# EasyEDA Pro project OpenCardiographySignalMeasuringDevice.epro, schematic MasterProject

## Sheets
1 Power
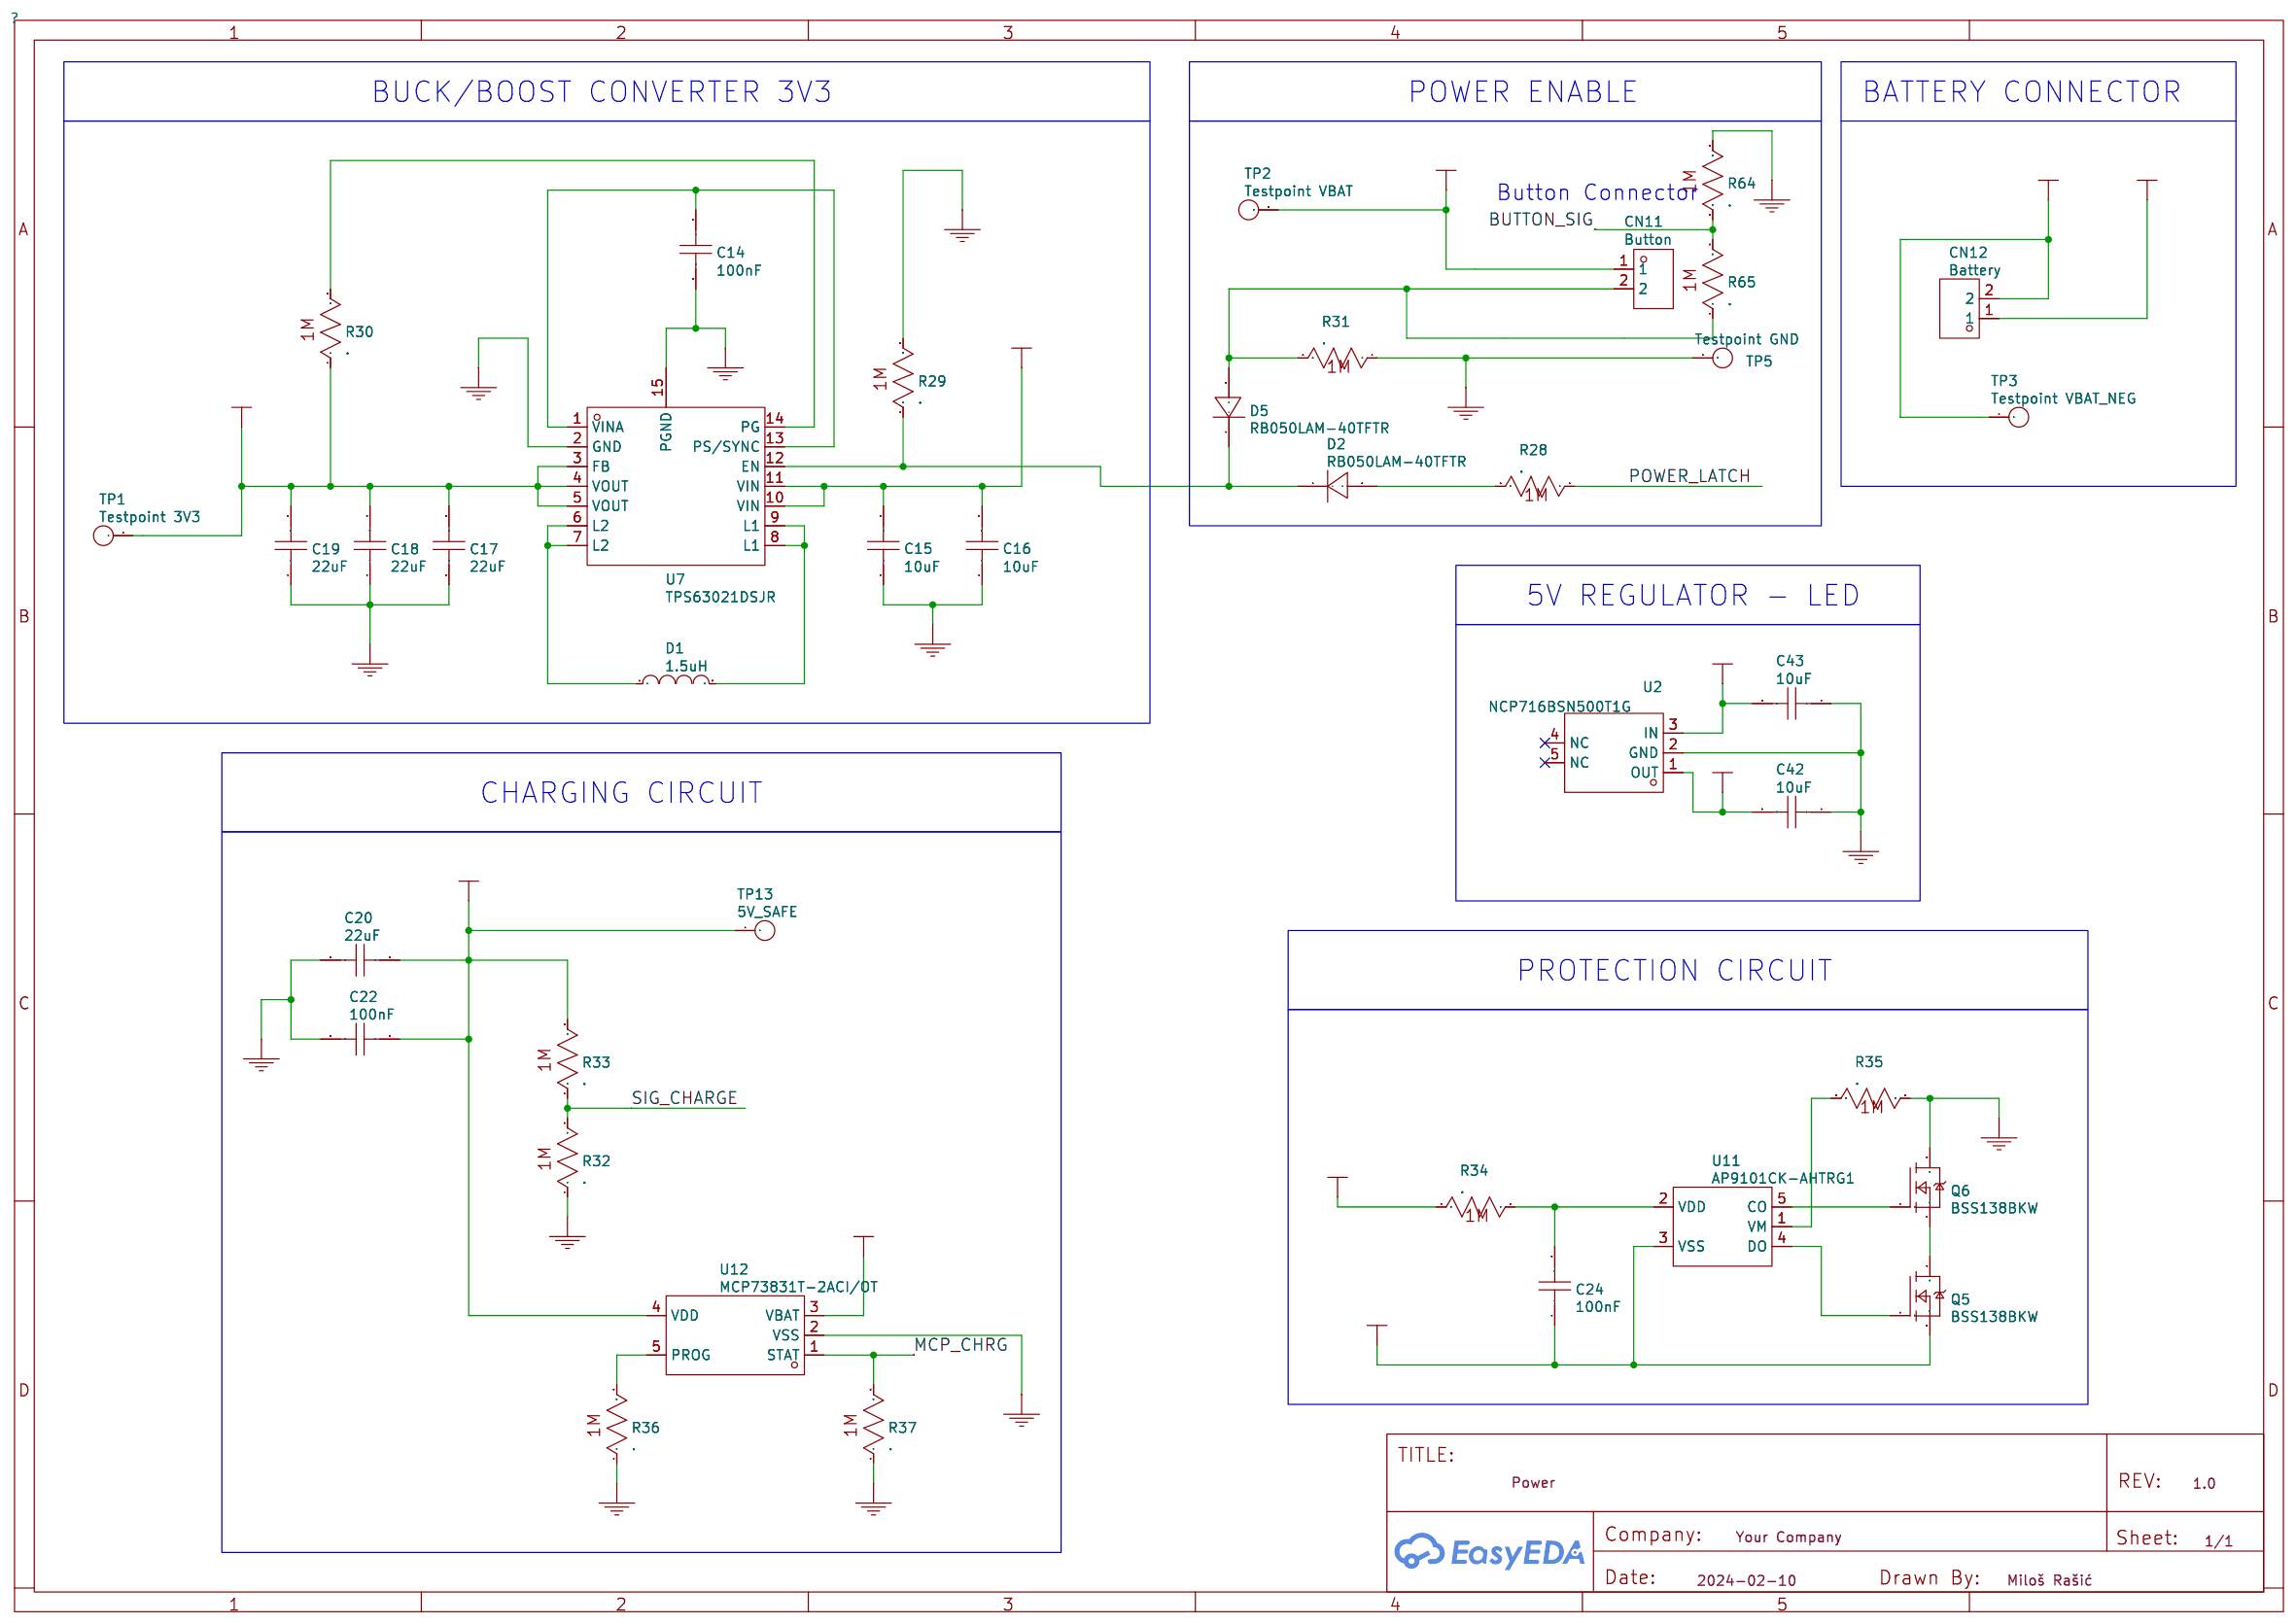
[diagram p0: Power]
2 ECG
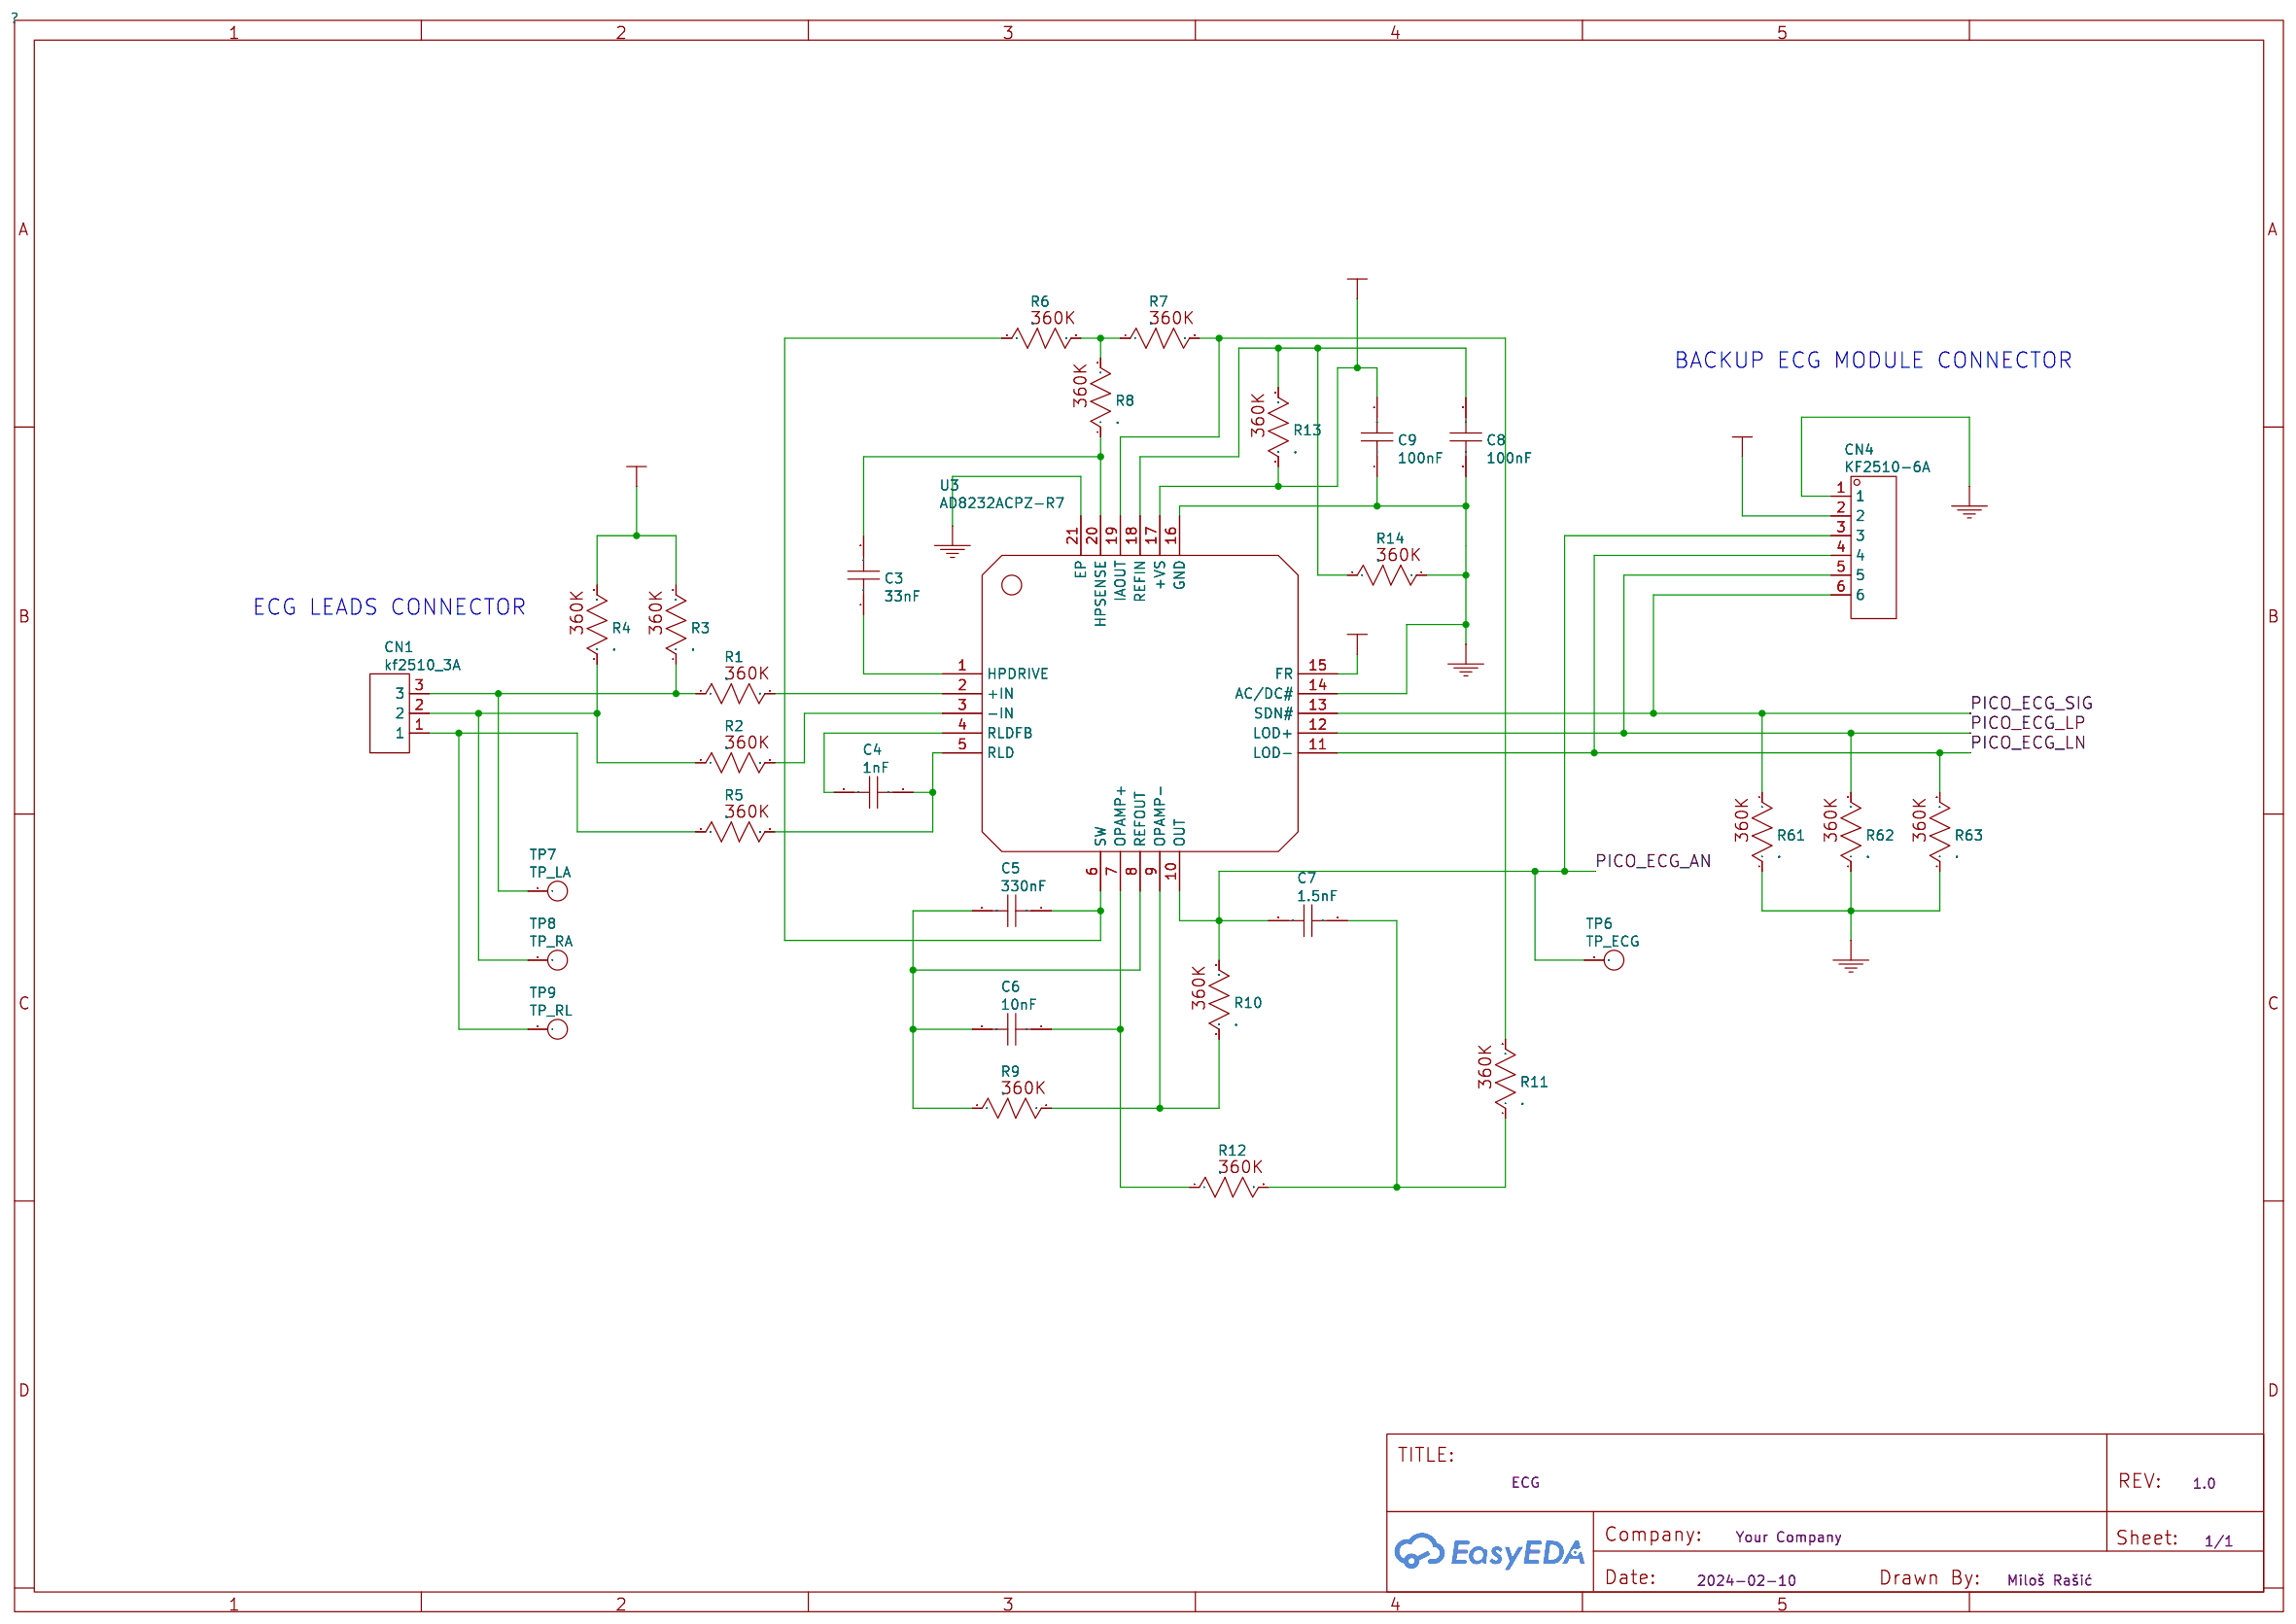
[diagram p1: ECG]
3 USB Isolator
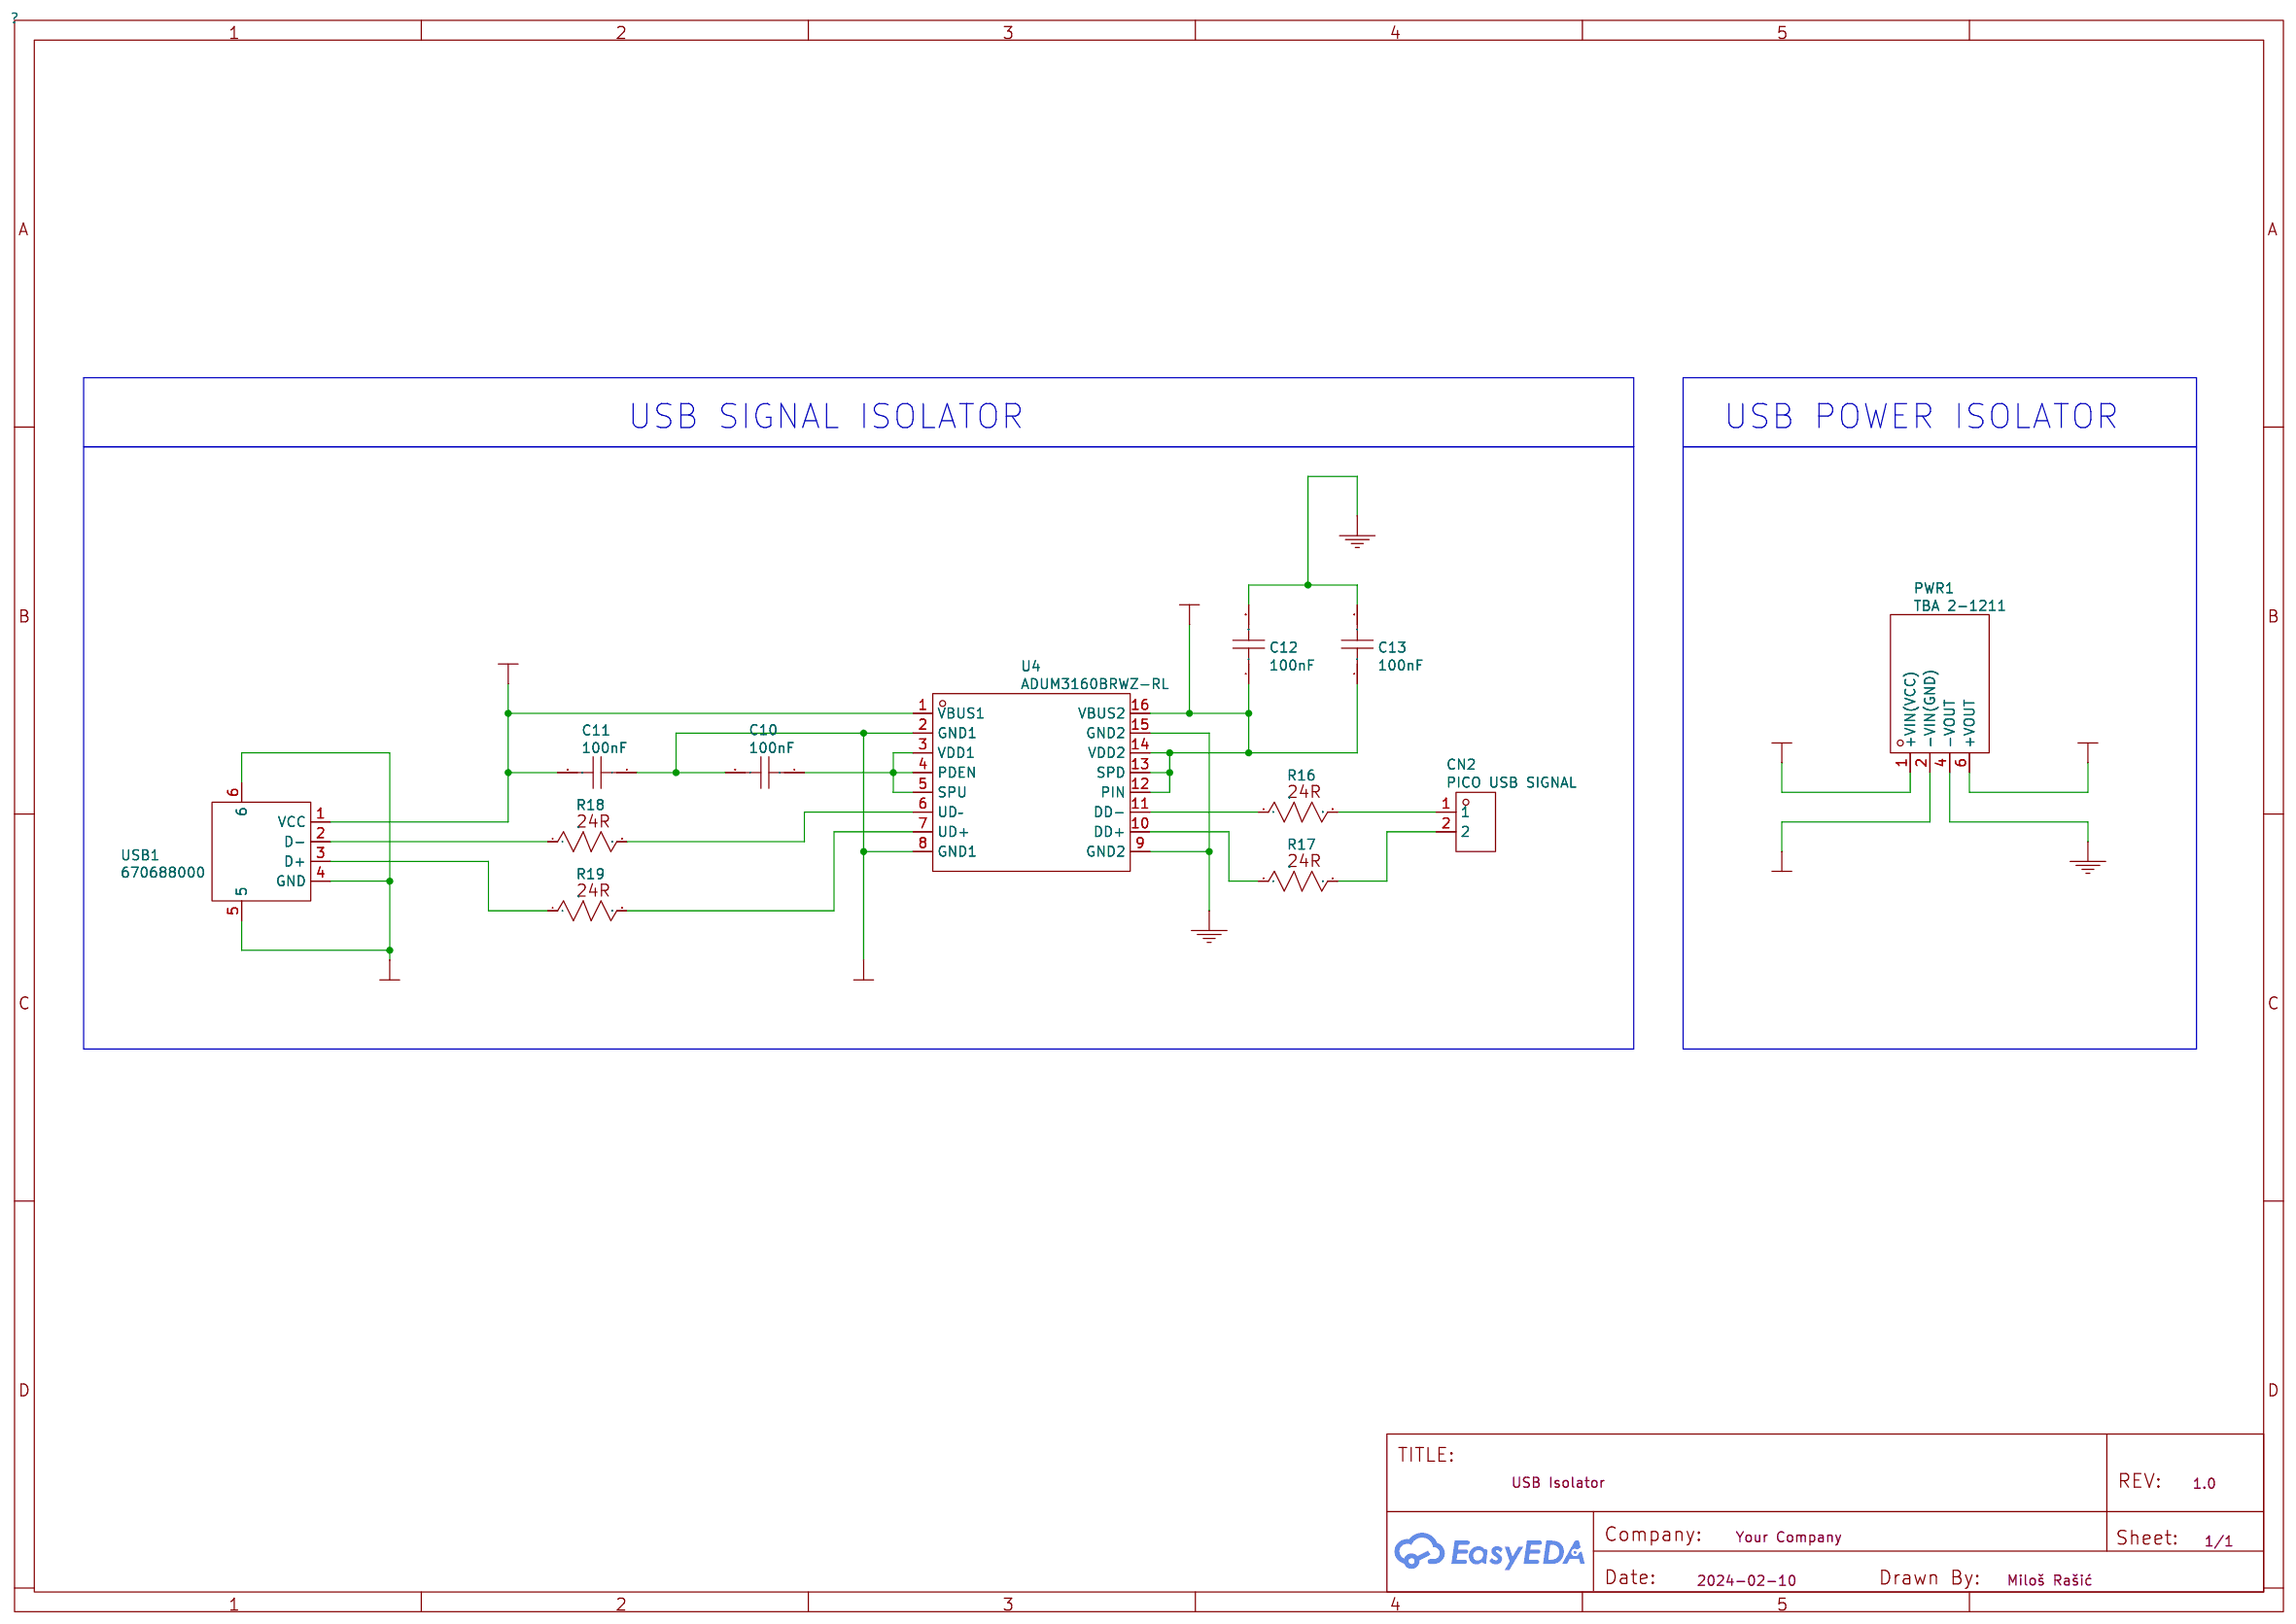
[diagram p2: USB Isolator]
4 MCU - Pico
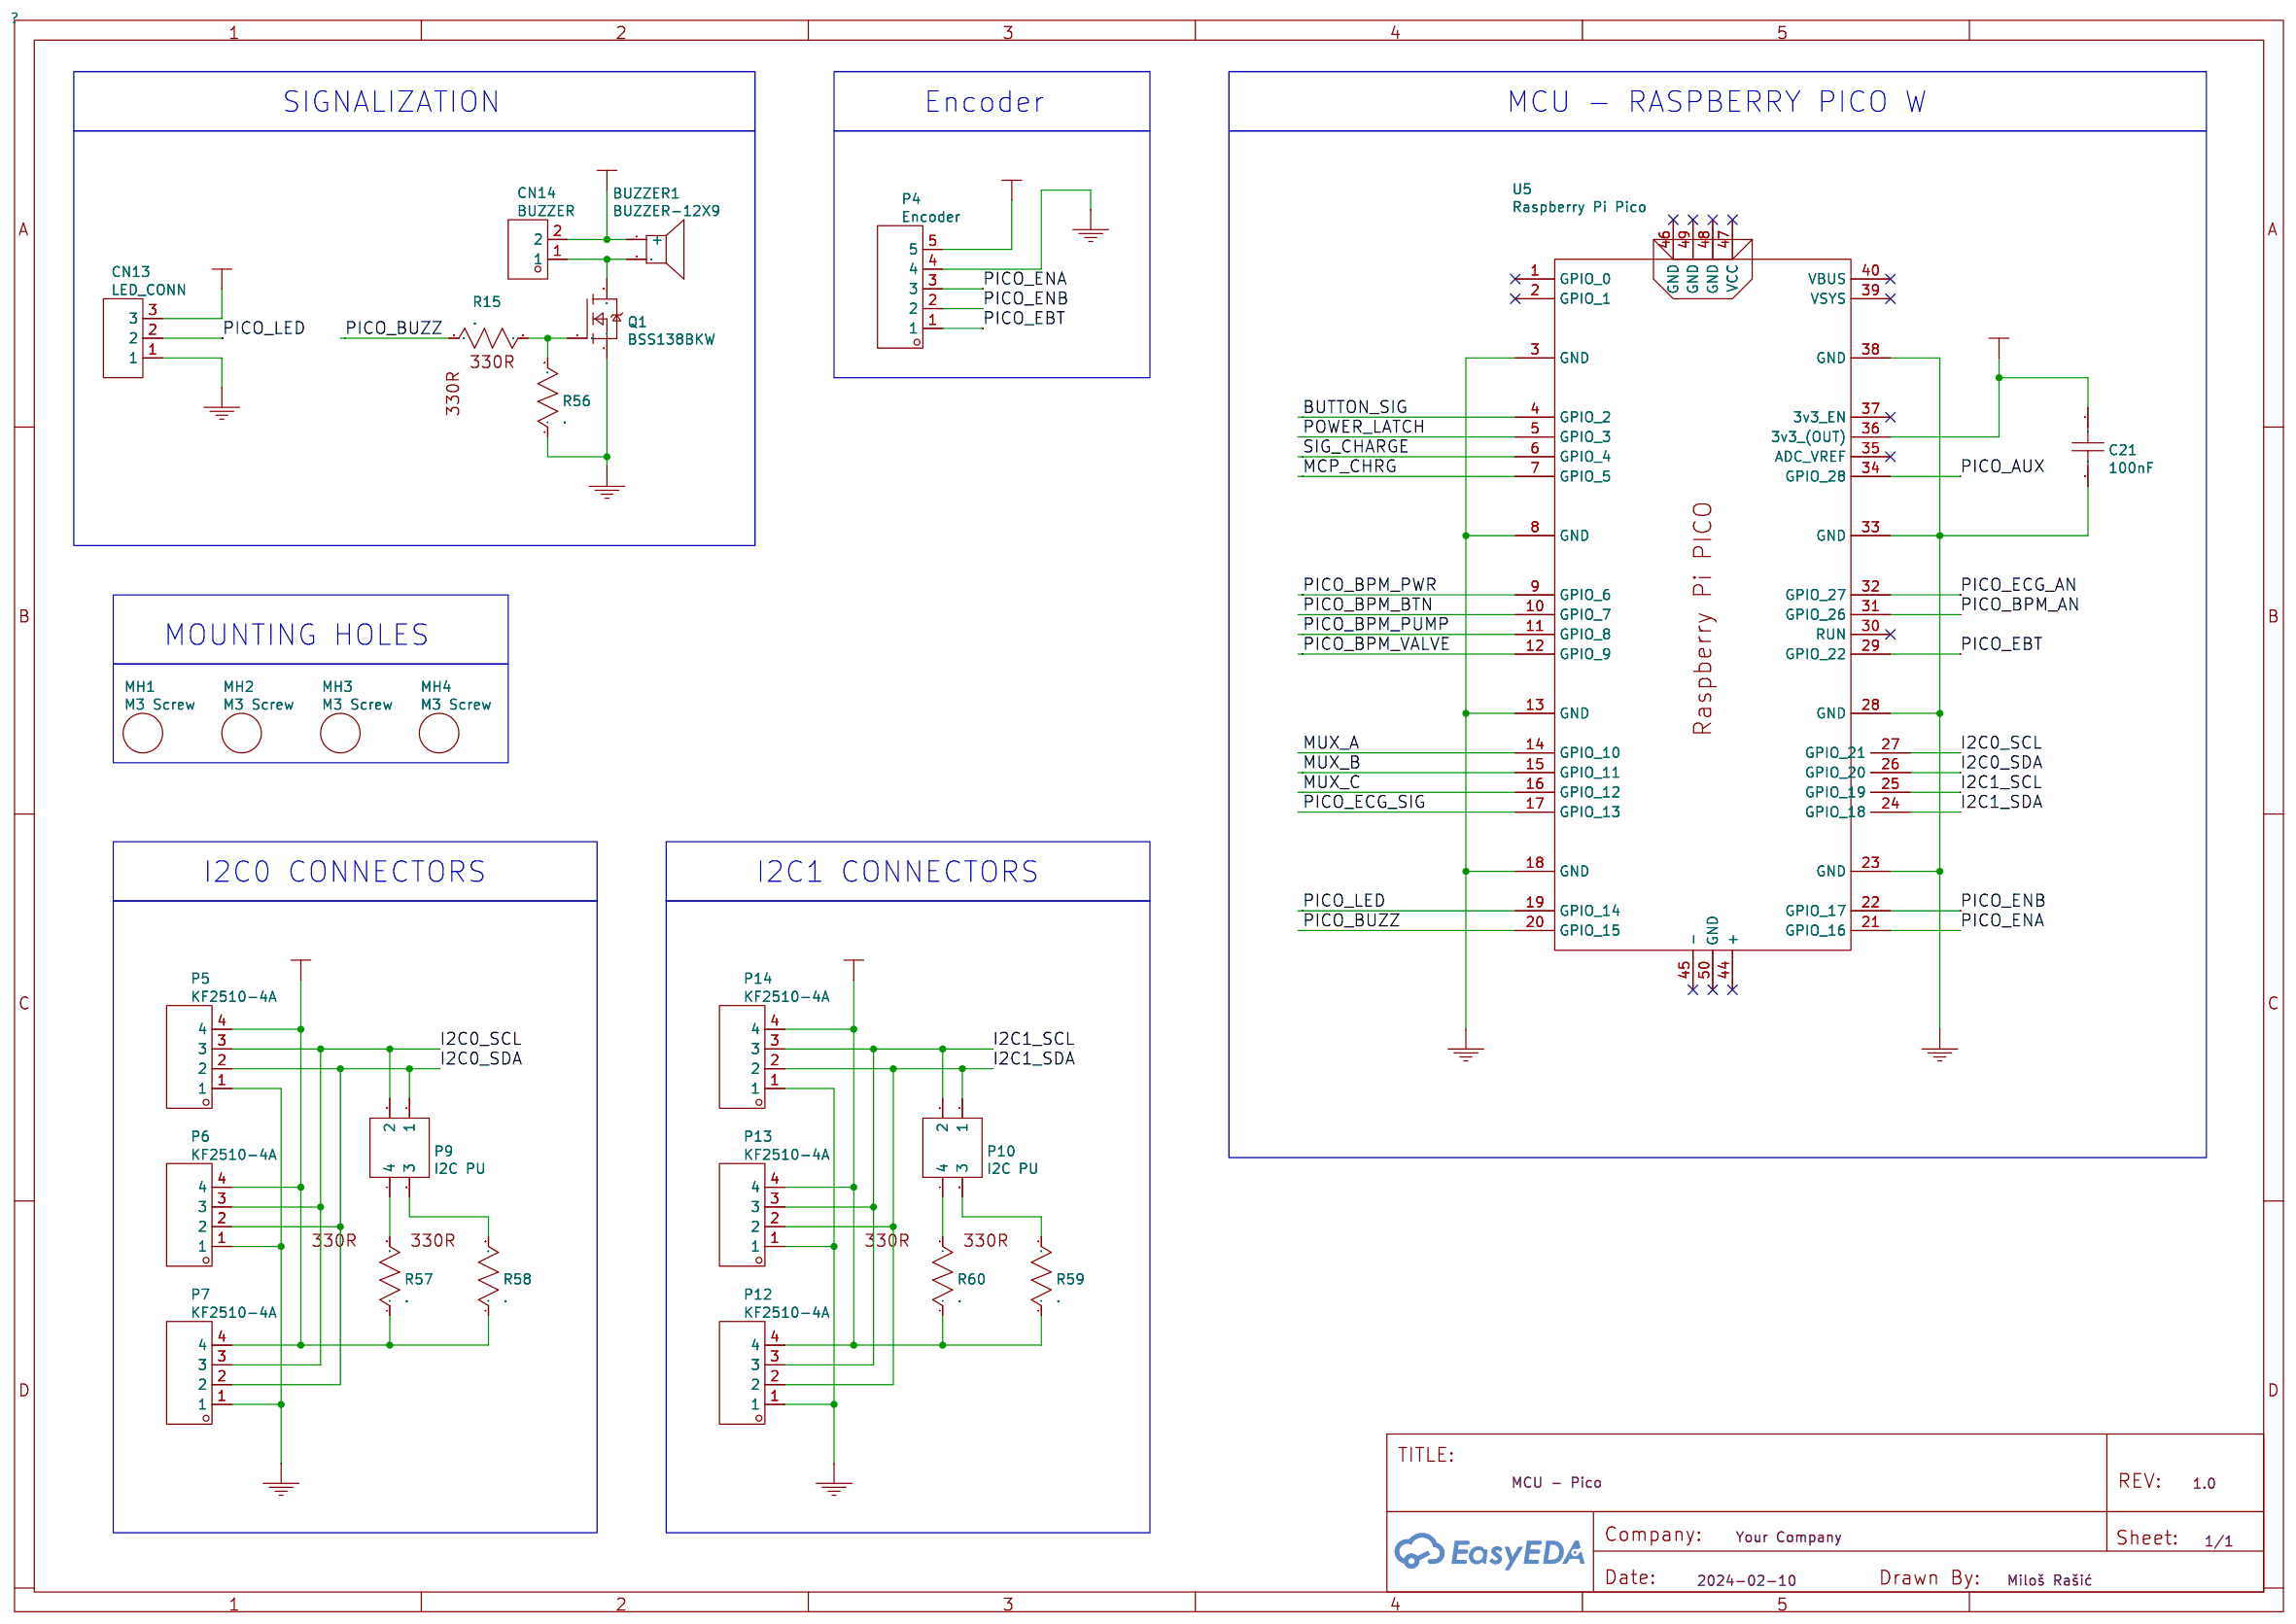
[diagram p3: MCU - Pico]
5 AUX Input
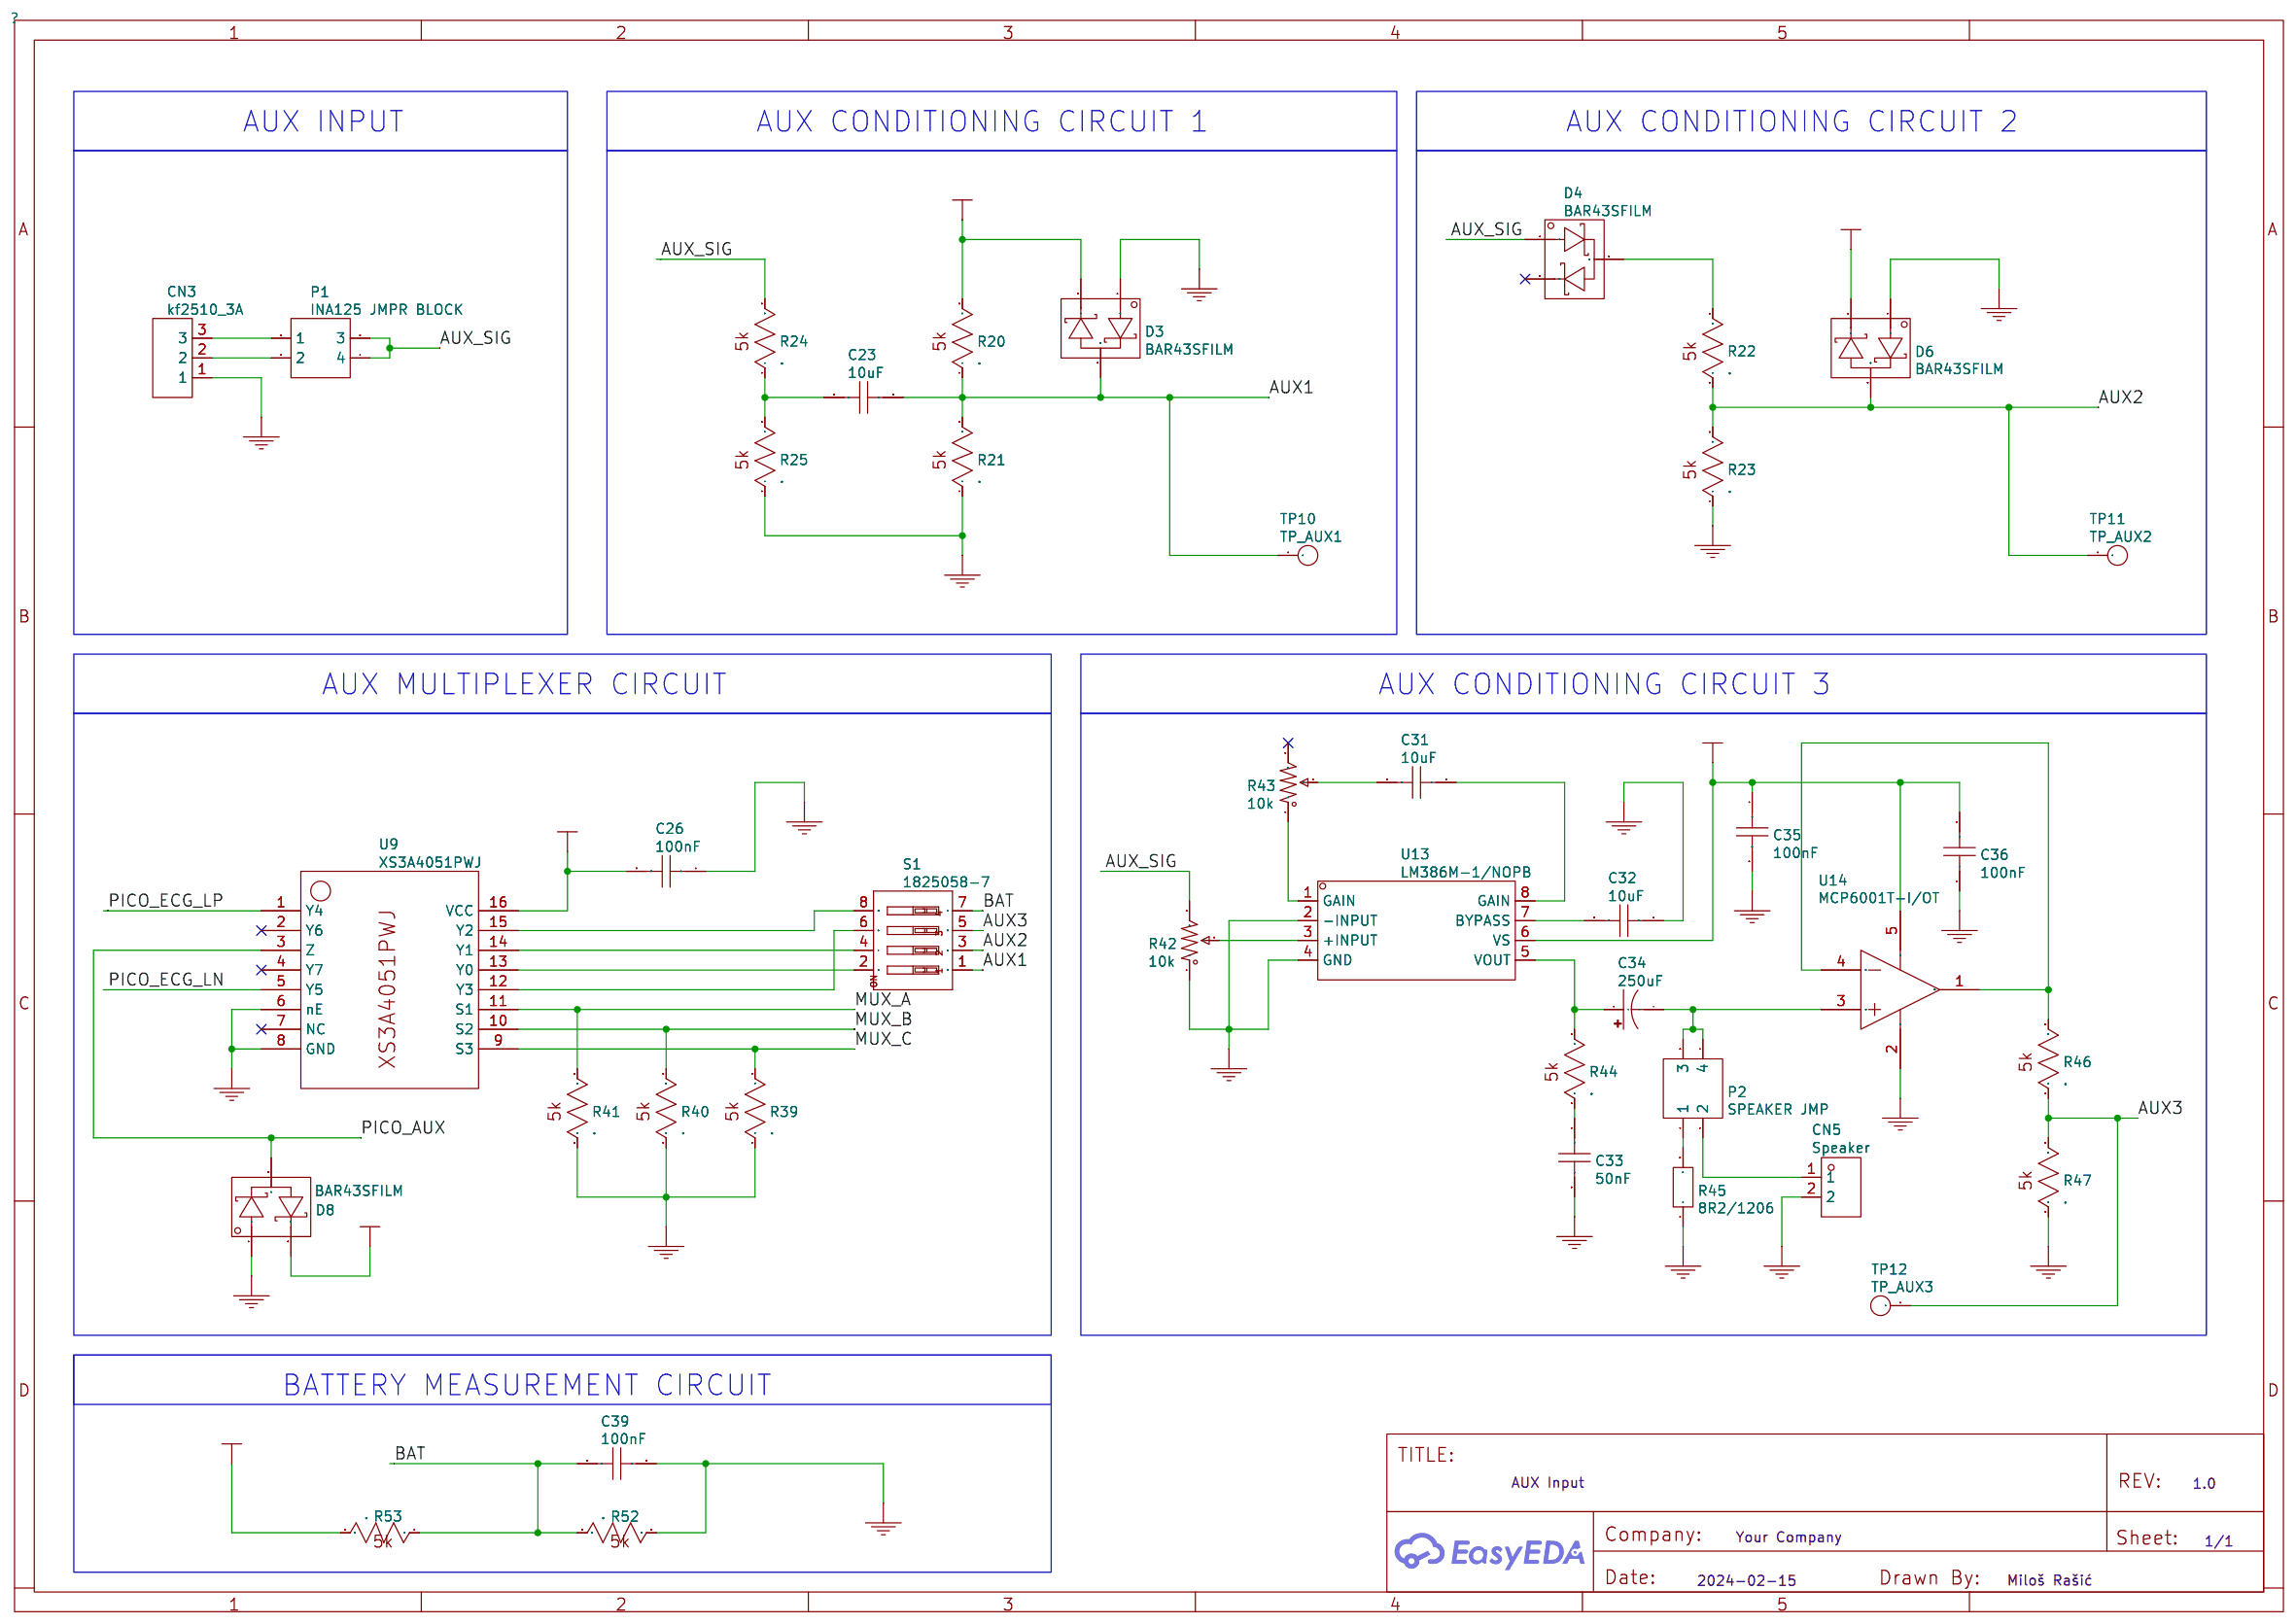
[diagram p4: AUX Input]
6 BPM
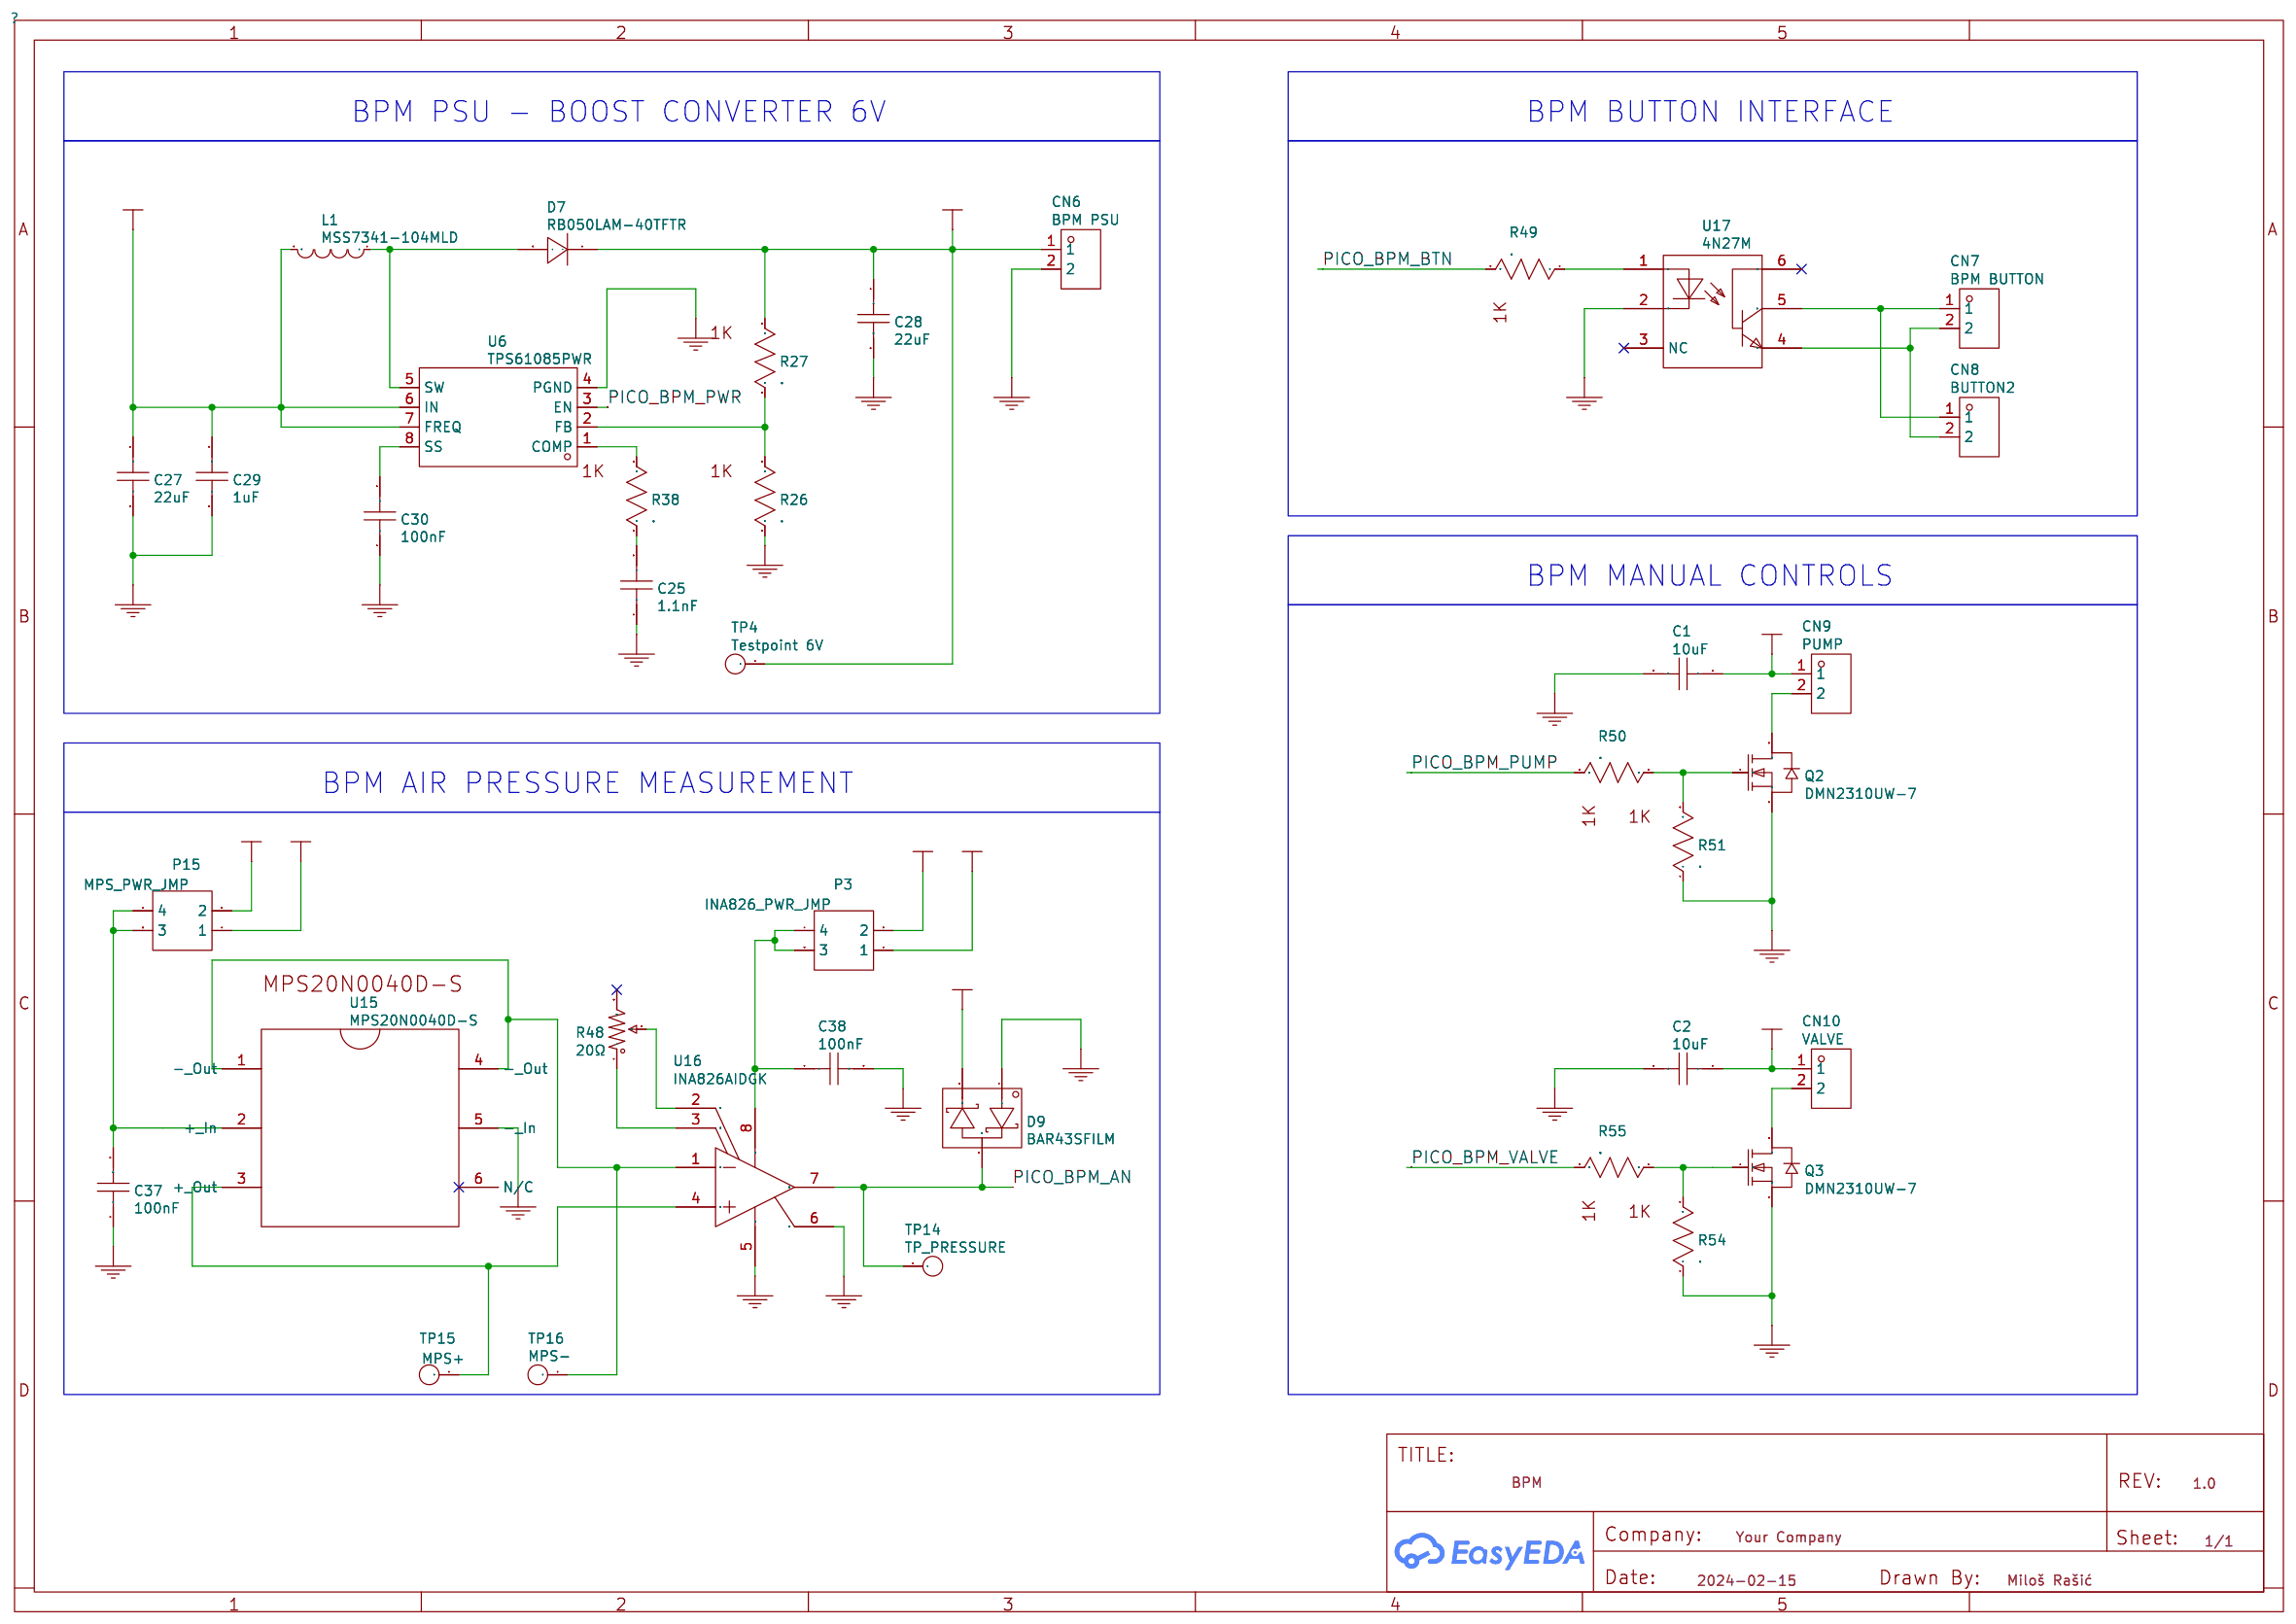
[diagram p5: BPM]

## Parts
sheet AUX Input
C23  10uF  [C0805]
C26  100nF  [C0603]
C31  10uF  [C0805]
C32  10uF  [C0805]
C33  50nF  [C0603]
C34  250uF  [8X10.5]
C35  100nF  [C0603]
C36  100nF  [C0603]
C39  100nF  [C0603]
CN3  kf2510_3A  [CONN-TH_3P-P2.00_KF2510_3A]
CN5  Speaker  [CONN-TH_KF2510-2A]
D3  BAR43SFILM  [SOT-23_L2.9-W1.3-P1.90-LS2.4-BR]
D4  BAR43SFILM  [SOT-23_L2.9-W1.3-P1.90-LS2.4-BR]
D6  BAR43SFILM  [SOT-23_L2.9-W1.3-P1.90-LS2.4-BR]
D8  BAR43SFILM  [SOT-23_L2.9-W1.3-P1.90-LS2.4-BR]
P1  INA125 JMPR BLOCK  [2X2X2.54MM HEADER]
P2  SPEAKER JMP  [2X2X2.54MM HEADER]
R20  .  [20K OHM RESISTOR (0603) SMD - CRCW060320K0FKEAC]
R21  .  [20K OHM RESISTOR (0603) SMD - CRCW060320K0FKEAC]
R22  .  [20K OHM RESISTOR (0603) SMD - CRCW060320K0FKEAC]
R23  .  [20K OHM RESISTOR (0603) SMD - CRCW060320K0FKEAC]
R24  .  [20K OHM RESISTOR (0603) SMD - CRCW060320K0FKEAC]
R25  .  [20K OHM RESISTOR (0603) SMD - CRCW060320K0FKEAC]
R39  .  [20K OHM RESISTOR (0603) SMD - CRCW060320K0FKEAC]
R40  .  [20K OHM RESISTOR (0603) SMD - CRCW060320K0FKEAC]
R41  .  [20K OHM RESISTOR (0603) SMD - CRCW060320K0FKEAC]
R42  10k  [RES-ADJ-TH_3P-L9.5-W4.85-P2.50-BL-BS]
R43  10k  [RES-ADJ-TH_3P-L9.5-W4.85-P2.50-BL-BS]
R44  .  [20K OHM RESISTOR (0603) SMD - CRCW060320K0FKEAC]
R45  8R2/1206  [R1206]
R46  .  [20K OHM RESISTOR (0603) SMD - CRCW060320K0FKEAC]
R47  .  [20K OHM RESISTOR (0603) SMD - CRCW060320K0FKEAC]
R52  .  [20K OHM RESISTOR (0603) SMD - CRCW060320K0FKEAC]
R53  .  [20K OHM RESISTOR (0603) SMD - CRCW060320K0FKEAC]
S1  1825058-7  [SW_1825058-7]
TP10  TP_AUX1  [TESTPOINT]
TP11  TP_AUX2  [TESTPOINT]
TP12  TP_AUX3  [TESTPOINT]
U9  XS3A4051PWJ  [TSSOP16_]
U13  LM386M-1/NOPB  [SOIC-8_L4.9-W3.9-P1.27-LS6.0-BL-2]
U14  MCP6001T-I/OT  [SOT-23-5_L3.0-W1.7-P0.95-LS2.8-BR]
sheet BPM
C1  10uF  [C0805]
C2  10uF  [C0805]
C25  1.1nF  [C0603]
C27  22uF  [C0805]
C28  22uF  [C0805]
C29  1uF  [C0805]
C30  100nF  [C0603]
C37  100nF  [C0603]
C38  100nF  [C0603]
CN6  BPM PSU  [CONN-TH_KF2510-2A]
CN7  BPM BUTTON  [CONN-TH_KF2510-2A]
CN8  BUTTON2  [CONN-TH_KF2510-2A]
CN9  PUMP  [CONN-TH_KF2510-2A]
CN10  VALVE  [CONN-TH_KF2510-2A]
D7  RB050LAM-40TFTR  [SOD-128_L3.7-W2.5-LS4.7-RD]
D9  BAR43SFILM  [SOT-23_L2.9-W1.3-P1.90-LS2.4-BR]
L1  MSS7341-104MLD  [IND-SMD_L7.3-W7.3_MSS7341-104MLD]
P3  INA826_PWR_JMP  [2X2X2.54MM HEADER]
P15  MPS_PWR_JMP  [2X2X2.54MM HEADER]
Q2  DMN2310UW-7  [PG-SOT323-3_L2.0-W1.3-P1.30-LS2.1-BR]
Q3  DMN2310UW-7  [PG-SOT323-3_L2.0-W1.3-P1.30-LS2.1-BR]
R26  .  [20K OHM RESISTOR (0603) SMD - CRCW060320K0FKEAC]
R27  .  [20K OHM RESISTOR (0603) SMD - CRCW060320K0FKEAC]
R38  .  [20K OHM RESISTOR (0603) SMD - CRCW060320K0FKEAC]
R48  20Ω  [RES-ADJ-TH_3P-L9.5-W4.85-P2.50-BL-BS]
R49  .  [20K OHM RESISTOR (0603) SMD - CRCW060320K0FKEAC]
R50  .  [20K OHM RESISTOR (0603) SMD - CRCW060320K0FKEAC]
R51  .  [20K OHM RESISTOR (0603) SMD - CRCW060320K0FKEAC]
R54  .  [20K OHM RESISTOR (0603) SMD - CRCW060320K0FKEAC]
R55  .  [20K OHM RESISTOR (0603) SMD - CRCW060320K0FKEAC]
TP4  Testpoint 6V  [TESTPOINT]
TP14  TP_PRESSURE  [TESTPOINT]
TP15  MPS+  [TESTPOINT]
TP16  MPS-  [TESTPOINT]
U6  TPS61085PWR  [TSSOP-8_L4.4-W3.0-P0.65-LS6.4-BL]
U15  MPS20N0040D-S  [MPS20N0040D-S]
U16  INA826AIDGK  [VSSOP-8_L3.0-W3.0-P0.65-LS4.9-BL]
U17  4N27M  [DIP-6_L8.8-W6.4-P2.54-LS7.6-BL]
sheet ECG
C3  33nF  [C0603]
C4  1nF  [C0603]
C5  330nF  [C0603]
C6  10nF  [C0603]
C7  1.5nF  [C0603]
C8  100nF  [C0603]
C9  100nF  [C0603]
CN1  kf2510_3A  [CONN-TH_3P-P2.00_KF2510_3A]
CN4  KF2510-6A  [CONN-TH_KF2510-6A]
R1  .  [20K OHM RESISTOR (0603) SMD - CRCW060320K0FKEAC]
R2  .  [20K OHM RESISTOR (0603) SMD - CRCW060320K0FKEAC]
R3  .  [20K OHM RESISTOR (0603) SMD - CRCW060320K0FKEAC]
R4  .  [20K OHM RESISTOR (0603) SMD - CRCW060320K0FKEAC]
R5  .  [20K OHM RESISTOR (0603) SMD - CRCW060320K0FKEAC]
R6  .  [20K OHM RESISTOR (0603) SMD - CRCW060320K0FKEAC]
R7  .  [20K OHM RESISTOR (0603) SMD - CRCW060320K0FKEAC]
R8  .  [20K OHM RESISTOR (0603) SMD - CRCW060320K0FKEAC]
R9  .  [20K OHM RESISTOR (0603) SMD - CRCW060320K0FKEAC]
R10  .  [20K OHM RESISTOR (0603) SMD - CRCW060320K0FKEAC]
R11  .  [20K OHM RESISTOR (0603) SMD - CRCW060320K0FKEAC]
R12  .  [20K OHM RESISTOR (0603) SMD - CRCW060320K0FKEAC]
R13  .  [20K OHM RESISTOR (0603) SMD - CRCW060320K0FKEAC]
R14  .  [20K OHM RESISTOR (0603) SMD - CRCW060320K0FKEAC]
R61  .  [20K OHM RESISTOR (0603) SMD - CRCW060320K0FKEAC]
R62  .  [20K OHM RESISTOR (0603) SMD - CRCW060320K0FKEAC]
R63  .  [20K OHM RESISTOR (0603) SMD - CRCW060320K0FKEAC]
TP6  TP_ECG  [TESTPOINT]
TP7  TP_LA  [TESTPOINT]
TP8  TP_RA  [TESTPOINT]
TP9  TP_RL  [TESTPOINT]
U3  AD8232ACPZ-R7  [LFCSP-20_L4.0-W4.0-P0.50-TL-EP2.7]
sheet MCU - Pico
BUZZER1  BUZZER-12X9  [BUZ-TH_BD12.0-P7.60-D0.6-FD]
C21  100nF  [C0603]
CN13  LED_CONN  [CONN-TH_3P-P2.00_KF2510_3A]
CN14  BUZZER  [CONN-TH_KF2510-2A]
MH1  M3 Screw  [MOUNTINGHOLE-M3]
MH2  M3 Screw  [MOUNTINGHOLE-M3]
MH3  M3 Screw  [MOUNTINGHOLE-M3]
MH4  M3 Screw  [MOUNTINGHOLE-M3]
P4  Encoder  [CONN-TH_5P-P2.54_KF2510-5A]
P5  KF2510-4A  [CONN-TH_4P-P2.54_KF2510-4A]
P6  KF2510-4A  [CONN-TH_4P-P2.54_KF2510-4A]
P7  KF2510-4A  [CONN-TH_4P-P2.54_KF2510-4A]
P9  I2C PU  [2X2X2.54MM HEADER]
P10  I2C PU  [2X2X2.54MM HEADER]
P12  KF2510-4A  [CONN-TH_4P-P2.54_KF2510-4A]
P13  KF2510-4A  [CONN-TH_4P-P2.54_KF2510-4A]
P14  KF2510-4A  [CONN-TH_4P-P2.54_KF2510-4A]
Q1  BSS138BKW  [SOT323]
R15  .  [20K OHM RESISTOR (0603) SMD - CRCW060320K0FKEAC]
R56  .  [20K OHM RESISTOR (0603) SMD - CRCW060320K0FKEAC]
R57  .  [20K OHM RESISTOR (0603) SMD - CRCW060320K0FKEAC]
R58  .  [20K OHM RESISTOR (0603) SMD - CRCW060320K0FKEAC]
R59  .  [20K OHM RESISTOR (0603) SMD - CRCW060320K0FKEAC]
R60  .  [20K OHM RESISTOR (0603) SMD - CRCW060320K0FKEAC]
U5  Raspberry Pi Pico  [RASPBERRY PI PICO/ RASPBERRY PI PICO W]
sheet Power
C14  100nF  [C0603]
C15  10uF  [C0805]
C16  10uF  [C0805]
C17  22uF  [C0805]
C18  22uF  [C0805]
C19  22uF  [C0805]
C20  22uF  [C0805]
C22  100nF  [C0603]
C24  100nF  [C0603]
C42  10uF  [C0805]
C43  10uF  [C0805]
CN11  Button  [CONN-TH_KF2510-2A]
CN12  Battery  [CONN-TH_KF2510-2A]
D1  1.5uH  [IND-SMD_L3.0-W3.0-HPC3015TF-2R2M]
D2  RB050LAM-40TFTR  [SOD-128_L3.7-W2.5-LS4.7-RD]
D5  RB050LAM-40TFTR  [SOD-128_L3.7-W2.5-LS4.7-RD]
Q5  BSS138BKW  [SOT323]
Q6  BSS138BKW  [SOT323]
R28  .  [20K OHM RESISTOR (0603) SMD - CRCW060320K0FKEAC]
R29  .  [20K OHM RESISTOR (0603) SMD - CRCW060320K0FKEAC]
R30  .  [20K OHM RESISTOR (0603) SMD - CRCW060320K0FKEAC]
R31  .  [20K OHM RESISTOR (0603) SMD - CRCW060320K0FKEAC]
R32  .  [20K OHM RESISTOR (0603) SMD - CRCW060320K0FKEAC]
R33  .  [20K OHM RESISTOR (0603) SMD - CRCW060320K0FKEAC]
R34  .  [20K OHM RESISTOR (0603) SMD - CRCW060320K0FKEAC]
R35  .  [20K OHM RESISTOR (0603) SMD - CRCW060320K0FKEAC]
R36  .  [20K OHM RESISTOR (0603) SMD - CRCW060320K0FKEAC]
R37  .  [20K OHM RESISTOR (0603) SMD - CRCW060320K0FKEAC]
R64  .  [20K OHM RESISTOR (0603) SMD - CRCW060320K0FKEAC]
R65  .  [20K OHM RESISTOR (0603) SMD - CRCW060320K0FKEAC]
TP1  Testpoint 3V3  [TESTPOINT]
TP2  Testpoint VBAT  [TESTPOINT]
TP3  Testpoint VBAT_NEG  [TESTPOINT]
TP5  Testpoint GND  [TESTPOINT]
TP13  5V_SAFE  [TESTPOINT]
U2  NCP716BSN500T1G  [TSOP-5_L3.0-W1.5-P0.95-LS2.8-BL]
U7  TPS63021DSJR  [VSON-14_L4.0-W3.0-P0.50-BL-EP_TI_DSJ]
U11  AP9101CK-AHTRG1  [SOT-23-5_L3.0-W1.7-P0.95-LS2.8-BL]
U12  MCP73831T-2ACI/OT  [SOT-23-5_L3.0-W1.7-P0.95-LS2.8-BL]
sheet USB Isolator
C10  100nF  [C0603]
C11  100nF  [C0603]
C12  100nF  [C0603]
C13  100nF  [C0603]
CN2  PICO USB SIGNAL  [CONN-TH_KF2510-2A]
PWR1  TBA 2-1211  [PWRM-TH_TBA-2-1211]
R16  .  [20K OHM RESISTOR (0603) SMD - CRCW060320K0FKEAC]
R17  .  [20K OHM RESISTOR (0603) SMD - CRCW060320K0FKEAC]
R18  .  [20K OHM RESISTOR (0603) SMD - CRCW060320K0FKEAC]
R19  .  [20K OHM RESISTOR (0603) SMD - CRCW060320K0FKEAC]
U4  ADUM3160BRWZ-RL  [SOIC-16_L10.3-W7.5-P1.27-LS10.3-BL]
USB1  670688000  [USB-B-TH_67068-8000]

## Library data of the parts
C1 C2 C15 C16 C23 C31 C32 C42 C43 = 10uF: Supplier: LCSC; Supplier Part: C141031; Manufacturer: KEMET(基美); Manufacturer Part: C0805C106K4PAC7210; JLCPCB Part Class: Extended Part
C8-C14 C21 C22 C24 C26 C30 C35-C39 = 100nF: Supplier: LCSC; Manufacturer: Walsin(华新科); Manufacturer Part: 0603F104Z500CT; Supplier Part: C83060; JLCPCB Part Class: Extended Part; link: https://lcsc.com/eda_search?q=C83060&amp;%26type=1&amp;ref=editor
C33 = 50nF: Supplier: LCSC; Manufacturer: Walsin(华新科); Manufacturer Part: 0603F104Z500CT; Supplier Part: C83060; JLCPCB Part Class: Extended Part; link: https://lcsc.com/eda_search?q=C83060&amp;%26type=1&amp;ref=editor
C34 = 250uF
CN1 CN3 = kf2510_3A: Supplier: LCSC; Manufacturer: BOOMELE(博穆精密); Manufacturer Part: 2510-3A; Supplier Part: C29275; JLCPCB Part Class: Extended Part
CN5 = Speaker: Supplier: LCSC; Supplier Part: C9900020270; Manufacturer: null; Manufacturer Part: 外接电机-KF2510直针 两个针间距2.54mm; JLCPCB Part Class: Extended Part
D3 D4 D6 D8 D9 = BAR43SFILM: Supplier: LCSC; Supplier Part: C163328; Manufacturer: ST(意法半导体); JLCPCB Part Class: Extended Part
P1 = INA125 JMPR BLOCK: Supplier: Mouser; Manufacturer: ReliaPro; Manufacturer Part: Header-Female-2.54_1x4; Supplier Part: C124413
P2 = SPEAKER JMP: Supplier: Mouser; Manufacturer: ReliaPro; Manufacturer Part: Header-Female-2.54_1x4; Supplier Part: C124413
R1-R41 R44 R46 R47 R49-R65 = .: Manufacturer: Vishay/Dale; Manufacturer Part: 71-CRCW060320K0FKEAC; Supplier: Mouser; Supplier Part: CRCW060320K0FKEAC; link: https://www.mouser.com/datasheet/2/427/crcwce3-1223726.pdf
R42 R43 = 10k: Resistance: 5K; Supplier: LCSC; Supplier Part: C118907; Manufacturer: BOCHEN(博晨); Manufacturer Part: 3296W-1-502; JLCPCB Part Class: Extended Part; link: https://lcsc.com/eda_search?q=C118907&amp;%26type=1&amp;ref=editor
R45 = 8R2/1206: Supplier: LCSC; Supplier Part: C9900019753; Manufacturer: null; Manufacturer Part: 220K/1206; JLCPCB Part Class: Extended Part
S1 = 1825058-7
TP10 = TP_AUX1
TP11 = TP_AUX2
TP12 = TP_AUX3
U9 = XS3A4051PWJ: Manufacturer: NEXPERIA; Supplier: Element14; Supplier Part: 3934793; link: https://export.farnell.com/nexperia/xs3a4051pwj/analogue-sw-sp8t-40-to-125deg/dp/3934793
U13 = LM386M-1/NOPB: Supplier: LCSC; Supplier Part: C201575; Manufacturer: TI(德州仪器); JLCPCB Part Class: Extended Part
U14 = MCP6001T-I/OT: Supplier: LCSC; Manufacturer: MICROCHIP(美国微芯); Supplier Part: C116490; JLCPCB Part Class: Extended Part
C25 = 1.1nF: Supplier: LCSC; Manufacturer: Walsin(华新科); Manufacturer Part: 0603F104Z500CT; Supplier Part: C83060; JLCPCB Part Class: Extended Part; link: https://lcsc.com/eda_search?q=C83060&amp;%26type=1&amp;ref=editor
C17-C20 C27 C28 = 22uF: Supplier: LCSC; Supplier Part: C452754; Manufacturer: KEMET(基美); Manufacturer Part: C0805C226M9PACTU; JLCPCB Part Class: Extended Part
C29 = 1uF: Supplier: LCSC; Supplier Part: C452754; Manufacturer: KEMET(基美); Manufacturer Part: C0805C226M9PACTU; JLCPCB Part Class: Extended Part
CN6 = BPM PSU: Supplier: LCSC; Supplier Part: C9900020270; Manufacturer: null; Manufacturer Part: 外接电机-KF2510直针 两个针间距2.54mm; JLCPCB Part Class: Extended Part
CN7 = BPM BUTTON: Supplier: LCSC; Supplier Part: C9900020270; Manufacturer: null; Manufacturer Part: 外接电机-KF2510直针 两个针间距2.54mm; JLCPCB Part Class: Extended Part
CN8 = BUTTON2: Supplier: LCSC; Supplier Part: C9900020270; Manufacturer: null; Manufacturer Part: 外接电机-KF2510直针 两个针间距2.54mm; JLCPCB Part Class: Extended Part
CN9 = PUMP: Supplier: LCSC; Supplier Part: C9900020270; Manufacturer: null; Manufacturer Part: 外接电机-KF2510直针 两个针间距2.54mm; JLCPCB Part Class: Extended Part
CN10 = VALVE: Supplier: LCSC; Supplier Part: C9900020270; Manufacturer: null; Manufacturer Part: 外接电机-KF2510直针 两个针间距2.54mm; JLCPCB Part Class: Extended Part
D2 D5 D7 = RB050LAM-40TFTR: Supplier: LCSC; Supplier Part: C559341; Manufacturer: ROHM(罗姆); JLCPCB Part Class: Extended Part
L1 = MSS7341-104MLD: Supplier: LCSC; Supplier Part: C9900014058; Manufacturer: null; JLCPCB Part Class: Extended Part
P3 = INA826_PWR_JMP: Supplier: Mouser; Manufacturer: ReliaPro; Manufacturer Part: Header-Female-2.54_1x4; Supplier Part: C124413
P15 = MPS_PWR_JMP: Supplier: Mouser; Manufacturer: ReliaPro; Manufacturer Part: Header-Female-2.54_1x4; Supplier Part: C124413
Q2 Q3 = DMN2310UW-7: Supplier: RS-Online; Supplier Part: 222-2829; Manufacturer: DiodesZetex; JLCPCB Part Class: Extended Part
R48 = 20Ω: Resistance: 5K; Supplier: LCSC; Supplier Part: C118907; Manufacturer: BOCHEN(博晨); Manufacturer Part: 3296W-1-502; JLCPCB Part Class: Extended Part; link: https://lcsc.com/eda_search?q=C118907&amp;%26type=1&amp;ref=editor
TP4 = Testpoint 6V
TP14 = TP_PRESSURE
TP15 = MPS+
TP16 = MPS-
U6 = TPS61085PWR: Supplier: LCSC; Manufacturer: TI(德州仪器); Supplier Part: C13505; JLCPCB Part Class: Extended Part
U15 = MPS20N0040D-S: Supplier: Shenzhen Huaxincheng Electronics; Supplier Part: 20N0040D-S; link: https://softroboticstoolkit.com/files/sorotoolkit/files/mps20n0040d-s_datasheet.pdf
U16 = INA826AIDGK: Supplier: LCSC; Supplier Part: C1346075; Manufacturer: TI(德州仪器); JLCPCB Part Class: Extended Part; link: https://lcsc.com/eda_search?q=C1346075&amp;%26type=1&amp;ref=editor
U17 = 4N27M: Supplier: LCSC; Supplier Part: C136568; Manufacturer: onsemi(安森美); JLCPCB Part Class: Extended Part
C3 = 33nF: Supplier: LCSC; Manufacturer: Walsin(华新科); Manufacturer Part: 0603F104Z500CT; Supplier Part: C83060; JLCPCB Part Class: Extended Part; link: https://lcsc.com/eda_search?q=C83060&amp;%26type=1&amp;ref=editor
C4 = 1nF: Supplier: LCSC; Manufacturer: Walsin(华新科); Manufacturer Part: 0603F104Z500CT; Supplier Part: C83060; JLCPCB Part Class: Extended Part; link: https://lcsc.com/eda_search?q=C83060&amp;%26type=1&amp;ref=editor
C5 = 330nF: Supplier: LCSC; Manufacturer: Walsin(华新科); Manufacturer Part: 0603F104Z500CT; Supplier Part: C83060; JLCPCB Part Class: Extended Part; link: https://lcsc.com/eda_search?q=C83060&amp;%26type=1&amp;ref=editor
C6 = 10nF: Supplier: LCSC; Manufacturer: Walsin(华新科); Manufacturer Part: 0603F104Z500CT; Supplier Part: C83060; JLCPCB Part Class: Extended Part; link: https://lcsc.com/eda_search?q=C83060&amp;%26type=1&amp;ref=editor
C7 = 1.5nF: Supplier: LCSC; Manufacturer: Walsin(华新科); Manufacturer Part: 0603F104Z500CT; Supplier Part: C83060; JLCPCB Part Class: Extended Part; link: https://lcsc.com/eda_search?q=C83060&amp;%26type=1&amp;ref=editor
CN4 = KF2510-6A: Supplier Part: C27545; Supplier: LCSC; Manufacturer: ReliaPro
TP6 = TP_ECG
TP7 = TP_LA
TP8 = TP_RA
TP9 = TP_RL
U3 = AD8232ACPZ-R7: Supplier: LCSC; Manufacturer: ADI(亚德诺); Supplier Part: C43216; JLCPCB Part Class: Extended Part
BUZZER1 = BUZZER-12X9: Supplier: LCSC; Supplier Part: C9900016920; Manufacturer: null; Manufacturer Part: buzzer-12X9; JLCPCB Part Class: Extended Part
CN13 = LED_CONN: Supplier: LCSC; Manufacturer: BOOMELE(博穆精密); Manufacturer Part: 2510-3A; Supplier Part: C29275; JLCPCB Part Class: Extended Part
CN14 = BUZZER: Supplier: LCSC; Supplier Part: C9900020270; Manufacturer: null; Manufacturer Part: 外接电机-KF2510直针 两个针间距2.54mm; JLCPCB Part Class: Extended Part
MH1-MH4 = M3 Screw
P4 = Encoder: Supplier: LCSC; Manufacturer: BOOMELE(博穆精密); Manufacturer Part: 2510-5A; Supplier Part: C27544; JLCPCB Part Class: Extended Part
P5-P7 P12-P14 = KF2510-4A: Supplier Part: C27542; Supplier: LCSC; Manufacturer: ReliaPro; JLCPCB Part Class: Extended Part
P9 P10 = I2C PU: Supplier: Mouser; Manufacturer: ReliaPro; Manufacturer Part: Header-Female-2.54_1x4; Supplier Part: C124413
Q1 Q5 Q6 = BSS138BKW
U5 = Raspberry Pi Pico
CN11 = Button: Supplier: LCSC; Supplier Part: C9900020270; Manufacturer: null; Manufacturer Part: 外接电机-KF2510直针 两个针间距2.54mm; JLCPCB Part Class: Extended Part
CN12 = Battery: Supplier: LCSC; Supplier Part: C9900020270; Manufacturer: null; Manufacturer Part: 外接电机-KF2510直针 两个针间距2.54mm; JLCPCB Part Class: Extended Part
D1 = 1.5uH: Supplier: LCSC; Supplier Part: C2042645; Manufacturer: BOURNS; Manufacturer Part: SRN3015TA-1R5Y
TP1 = Testpoint 3V3
TP2 = Testpoint VBAT
TP3 = Testpoint VBAT_NEG
TP5 = Testpoint GND
TP13 = 5V_SAFE
U2 = NCP716BSN500T1G: Supplier: LCSC; Supplier Part: C603777; Manufacturer: onsemi(安森美); JLCPCB Part Class: Extended Part
U7 = TPS63021DSJR: Supplier: LCSC; Supplier Part: C202140; Manufacturer: TI(德州仪器); JLCPCB Part Class: Extended Part
U11 = AP9101CK-AHTRG1: Supplier: LCSC; Supplier Part: C5247262; Manufacturer: DIODES(美台)
U12 = MCP73831T-2ACI/OT: Supplier: LCSC; Supplier Part: C424093; Manufacturer: MICROCHIP(美国微芯); JLCPCB Part Class: Extended Part
CN2 = PICO USB SIGNAL: Supplier: LCSC; Supplier Part: C9900020270; Manufacturer: null; Manufacturer Part: 外接电机-KF2510直针 两个针间距2.54mm; JLCPCB Part Class: Extended Part
PWR1 = TBA 2-1211: Supplier: LCSC; Supplier Part: C5204791; Manufacturer: TRACO POWER; JLCPCB Part Class: Extended Part
U4 = ADUM3160BRWZ-RL: Supplier: LCSC; Supplier Part: C284149; Manufacturer: ADI(亚德诺); JLCPCB Part Class: Extended Part
USB1 = 670688000: Supplier: LCSC; Supplier Part: C114097; Manufacturer: MOLEX; JLCPCB Part Class: Extended Part

## Nets
3V3: C9.2 C12.1 C13.1 C17.2 C18.2 C19.2 C21.1 C26.2 CN4.2 D3.2 D6.2 D8.2 D9.2 P3.2 P4.5 P5.4 P6.4 P7.4 P12.4 P13.4 P14.4 P15.2 R3.2 R4.2 R13.1 R20.2 R30.1 R57.1 R58.1 R59.1 R60.1 TP1.1 U3.15(FR) U3.17(+VS) U4.12(PIN) U4.13(SPD) U4.14(VDD2) U4.16(VBUS2) U5.36(3v3 (OUT)) U7.3(FB) U7.4(VOUT) U7.5(VOUT) U9.16(VCC)
5V: BUZZER1.1(+) C42.2 CN13.3 CN14.2 U2.1(OUT)
5V_SAFE: C20.1 C22.1 PWR1.6(+VOUT) R33.2 TP13.1 U12.4(VDD)
5V_USB: C11.2 PWR1.1(+VIN(VCC)) U4.1(VBUS1) USB1.1(VCC)
6V: C1.1 C2.1 C28.1 C35.1 C36.1 C43.2 CN6.1 CN9.1 CN10.1 D7.1(-) P3.1 P15.1 R27.2 TP4.1 U2.3(IN) U13.6(VS) U14.5(VDD)
GND: C1.2 C2.2 C8.1 C9.1 C12.2 C13.2 C14.2 C15.1 C16.1 C17.1 C18.1 C19.1 C20.2 C21.2 C22.2 C25.1 C26.1 C27.2 C28.2 C29.2 C30.1 C32.1 C33.2 C35.2 C36.2 C37.1 C38.2 C39.2 C42.1 C43.1 CN3.1 CN4.1 CN5.2 CN6.2 CN13.1 D3.1 D6.1 D8.1 D9.1 P4.4 P5.1 P6.1 P7.1 P12.1 P13.1 P14.1 PWR1.4(-VOUT) Q1.2(S) Q2.2(S) Q3.2(S) Q6.3(D) R14.2 R21.1 R23.1 R25.1 R26.1 R29.2 R31.1 R32.1 R35.1 R36.1 R37.1 R39.1 R40.1 R41.1 R42.1 R45.1 R47.1 R51.1 R52.1 R54.1 R56.1 R61.1 R62.1 R63.1 R64.2 TP5.1 U2.2(GND) U3.14(AC/DC#) U3.16(GND) U3.21(EP) U4.9(GND2) U4.15(GND2) U5.3(GND) U5.8(GND) U5.13(GND) U5.18(GND) U5.23(GND) U5.28(GND) U5.33(GND) U5.38(GND) U6.4(PGND) U7.2(GND) U7.15(PGND) U9.6(nE) U9.8(GND) U12.2(VSS) U13.2(-INPUT) U13.4(GND) U14.2(VSS) U15.5(- In) U16.5(VS-) U16.6(REF) U17.2
VBAT: C15.2 C16.2 C27.1 C29.1 CN11.1 CN12.1 L1.2 R34.2 R53.2 TP2.1 U6.6(IN) U6.7(FREQ) U7.10(VIN) U7.11(VIN) U12.3(VBAT)
VBAT_NEG: C24.1 CN12.2 Q5.2(S) TP3.1 U11.3(VSS)
AUX1: C23.1 D3.3 R20.1 R21.2 S1.1 TP10.1
AUX2: D6.3 R22.1 R23.2 S1.3 TP11.1
AUX3: R46.1 R47.2 S1.5 TP12.1
AUX_SIG: D4.1 P1.3 P1.4 R24.2 R42.3
BAT: C39.1 R52.2 R53.1 S1.7
BUTTON_SIG: R64.1 R65.2 U5.4(GPIO 2)
I2C0_SCL: P5.3 P6.3 P7.3 P9.2 U5.27(GPIO 21)
I2C0_SDA: P5.2 P6.2 P7.2 P9.1 U5.26(GPIO 20)
I2C1_SCL: P10.2 P12.3 P13.3 P14.3 U5.25(GPIO 19)
I2C1_SDA: P10.1 P12.2 P13.2 P14.2 U5.24(GPIO 18)
MCP_CHRG: R37.2 U5.7(GPIO 5) U12.1(STAT)
MUX_A: R41.2 U5.14(GPIO 10) U9.11(S1)
MUX_B: R40.2 U5.15(GPIO 11) U9.10(S2)
MUX_C: R39.2 U5.16(GPIO 12) U9.9(S3)
PICO_AUX: D8.3 U5.34(GPIO 28) U9.3(Z)
PICO_BPM_AN: D9.3 TP14.1 U5.31(GPIO 26) U16.7(VOUT)
PICO_BPM_BTN: R49.2 U5.10(GPIO 7)
PICO_BPM_PUMP: R50.2 U5.11(GPIO 8)
PICO_BPM_PWR: U5.9(GPIO 6) U6.3(EN)
PICO_BPM_VALVE: R55.2 U5.12(GPIO 9)
PICO_BUZZ: R15.2 U5.20(GPIO 15)
PICO_EBT: P4.1 U5.29(GPIO 22)
PICO_ECG_AN: C7.2 CN4.3 R10.2 TP6.1 U3.10(OUT) U5.32(GPIO 27)
PICO_ECG_LN: CN4.4 R63.2 U3.11(LOD-) U9.5(Y5)
PICO_ECG_LP: CN4.5 R62.2 U3.12(LOD+) U9.1(Y4)
PICO_ECG_SIG: CN4.6 R61.2 U3.13(SDN#) U5.17(GPIO 13)
PICO_ENA: P4.3 U5.21(GPIO 16)
PICO_ENB: P4.2 U5.22(GPIO 17)
PICO_LED: CN13.2 U5.19(GPIO 14)
POWER_LATCH: R28.1 U5.5(GPIO 3)
SIG_CHARGE: R32.2 R33.1 U5.6(GPIO 4)
USB_GND: C10.2 C11.1 PWR1.2(-VIN(GND)) U4.2(GND1) U4.8(GND1) USB1.4(GND) USB1.5 USB1.6
BUZZER1_2: BUZZER1.2 CN14.1 Q1.3(D)
C7_1: C7.1 R11.1 R12.2
C14_1: C14.1 U7.1(VINA) U7.13(PS/SYNC)
C23_2: C23.2 R24.1 R25.2
C24_2: C24.2 R34.1 U11.2(VDD)
C34_-: C34.- P2.3 P2.4 U14.3(VIN+)
C37_2: C37.2 P15.3 P15.4 U15.2(+ In)
CN1_1: CN1.1 R5.1 TP9.1
CN3_2: CN3.2 P1.2
CN3_3: CN3.3 P1.1
CN9_2: CN9.2 Q2.3(D)
CN10_2: CN10.2 Q3.3(D)
D1_1: D1.1 U7.6(L2) U7.7(L2)
D1_2: D1.2 U7.8(L1) U7.9(L1)
D4_3: D4.3 R22.2
D5_1: D2.1(-) D5.1(-) R29.1 U7.12(EN)
P2_2: CN5.1 P2.2
P9_3: P9.3 R58.2
P9_4: P9.4 R57.2
Q1_1: Q1.1(G) R15.1 R56.2
Q5_1: Q5.1(G) U11.4(DO)
Q6_1: Q6.1(G) U11.5(CO)
Q6_2: Q5.3(D) Q6.2(S)
R1_1: CN1.3 R1.1 R3.1 TP7.1
R2_1: CN1.2 R2.1 R4.1 TP8.1
R6_2: R6.2 R7.1 R8.2
R16_2: CN2.1 R16.2
R17_2: CN2.2 R17.2
R18_1: R18.1 USB1.2(D-)
R19_1: R19.1 USB1.3(D+)
R28_2: D2.2(+) R28.2
R30_2: R30.2 U7.14(PG)
R31_2: CN11.2 D5.2(+) R31.2 R65.1
R35_2: R35.2 U11.1(VM)
R36_2: R36.2 U12.5(PROG)
R38_1: C25.2 R38.1
R43_2: C31.2 R43.2
R44_1: C33.1 R44.1
R45_2: P2.1 R45.2
R50_1: Q2.1(G) R50.1 R51.2
R54_2: Q3.1(G) R54.2 R55.1
R59_2: P10.3 R59.2
R60_2: P10.4 R60.2
U3_1: C3.1 U3.1(HPDRIVE)
U3_2: R1.2 U3.2(+IN)
U3_3: R2.2 U3.3(-IN)
U3_4: C4.2 U3.4(RLDFB)
U3_5: C4.1 R5.2 U3.5(RLD)
U3_6: C5.1 R6.1 U3.6(SW)
U3_7: C6.1 R12.1 U3.7(OPAMP+)
U3_8: C5.2 C6.2 R9.1 U3.8(REFOUT)
U3_9: R9.2 R10.1 U3.9(OPAMP-)
U3_18: C8.2 R13.2 R14.1 U3.18(REFIN)
U3_19: R7.2 R11.2 U3.19(IAOUT)
U3_20: C3.2 R8.1 U3.20(HPSENSE)
U4_3: C10.1 U4.3(VDD1) U4.4(PDEN) U4.5(SPU)
U4_6: R18.2 U4.6(UD–)
U4_7: R19.2 U4.7(UD+)
U4_10: R17.1 U4.10(DD+)
U4_11: R16.1 U4.11(DD-)
U6_1: R38.2 U6.1(COMP)
U6_2: R26.2 R27.1 U6.2(FB)
U6_5: D7.2(+) L1.1 U6.5(SW)
U6_8: C30.2 U6.8(SS)
U9_12: S1.6 U9.12(Y3)
U9_13: S1.2 U9.13(Y0)
U9_14: S1.4 U9.14(Y1)
U9_15: S1.8 U9.15(Y2)
U13_1: R43.1 U13.1(GAIN)
U13_3: R42.2 U13.3(+INPUT)
U13_5: C34.+ R44.2 U13.5(VOUT)
U13_7: C32.2 U13.7(BYPASS)
U13_8: C31.1 U13.8(GAIN)
U14_4: R46.2 U14.1(VOUT) U14.4(VIN-)
U15_1: TP16.1 U15.1(- Out) U15.4(- Out) U16.1(IN-)
U15_3: TP15.1 U15.3(+ Out) U16.4(IN+)
U16_2: R48.2 U16.2(RG)
U16_3: R48.1 U16.3(RG)
U16_8: C38.1 P3.3 P3.4 U16.8(VS+)
U17_1: R49.1 U17.1
U17_4: CN7.2 CN8.2 U17.4
U17_5: CN7.1 CN8.1 U17.5

Not connected (* = marked no-connect by the designer): D4 2*; R43 3*; R48 3*; U2 4(NC)* 5(NC)*; U5 1(GPIO 0)* 2(GPIO 1)* 30(RUN)* 35(ADC_VREF)* 37(3v3_EN)* 39(VSYS)* 40(VBUS)* 44(+)* 45(-)* 46(GND)* 47(VCC)* 48(GND)* 49(GND)* 50(GND)*; U9 2(Y6)* 4(Y7)* 7(NC)*; U15 6(N/C)*; U17 3(NC)* 6*

## Notes on the sheets
sheet 1
- BUCK/BOOST CONVERTER 3V3
- POWER ENABLE
- BATTERY CONNECTOR
- Button Connector
- 5V REGULATOR - LED
- CHARGING CIRCUIT
- PROTECTION CIRCUIT
sheet 2
- BACKUP ECG MODULE CONNECTOR
- ECG LEADS CONNECTOR
sheet 3
- USB SIGNAL ISOLATOR
- USB POWER ISOLATOR
sheet 4
- SIGNALIZATION
- Encoder
- MCU - RASPBERRY PICO W
- MOUNTING HOLES
- I2C0 CONNECTORS
- I2C1 CONNECTORS
sheet 5
- AUX INPUT
- AUX CONDITIONING CIRCUIT 1
- AUX CONDITIONING CIRCUIT 2
- AUX MULTIPLEXER CIRCUIT
- AUX CONDITIONING CIRCUIT 3
- BATTERY MEASUREMENT CIRCUIT
sheet 6
- BPM PSU - BOOST CONVERTER 6V
- BPM BUTTON INTERFACE
- BPM MANUAL CONTROLS
- BPM AIR PRESSURE MEASUREMENT
